# Altium schematic sheet ADC_8681.SchDoc: source ADC
size A4; Author: Watzek; DrawnBy: Watzek; Organization: HTL Hollabrunn; Address1: Abteilung Elektronik; Address2: Anton Ehrenfried-Straße 10; Address3: 2020 Hollabrunn; DocumentNumber: 04; Revision: 01; SheetNumber: 04; SheetTotal: 12; SPICEModelCacheSWPEVHXS: <root> / <DocumentId>SWPEVHXS</DocumentId> / <CacheFrame Number="0"> / <Model Name="cap" Kind="MDL"> / <Text>*Default semiconductor capacitor / .MODEL CAP C()</Text> / </Model> / </CacheFrame> / </root>
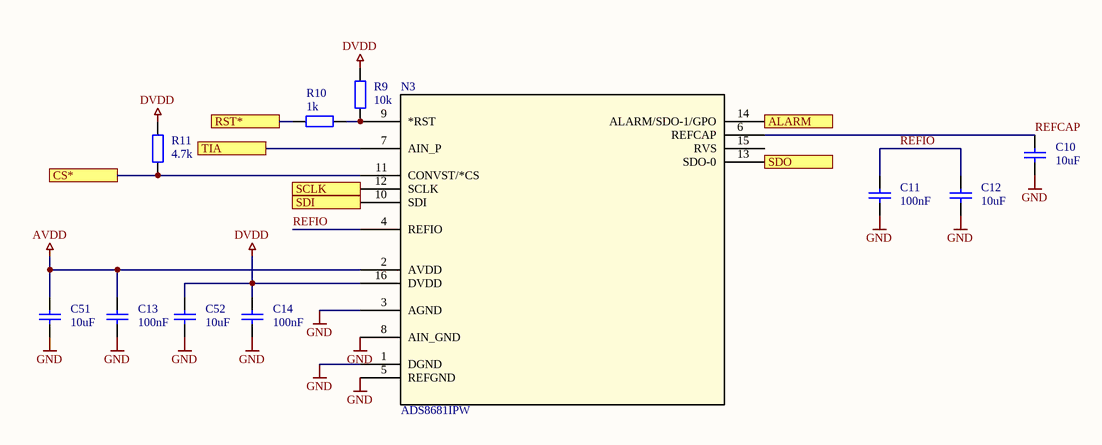
[diagram p0: ADC_8681.SchDoc]

## Parts
C10  10uF  [C1206-KUE]
C11  100nF  [C1206-KUE]
C12  10uF  [C1206-KUE]
C13  100nF  [C1206-KUE]
C14  100nF  [C1206-KUE]
C51  10uF  [C1206-KUE]
C52  10uF  [C1206-KUE]
N3  ADS8681IPW  [PW16_TEX]
R9  10k  [C1206-KUE]
R10  1k  [C1206-KUE]
R11  4.7k  [C1206-KUE]

## Ports
ALARM, CS*, RST*, SCLK, SDI, SDO, TIA

## Nets
AVDD: C13.2 C51.2 N3.2(AVDD)
DVDD: C14.2 C52.2 N3.16(DVDD) R9.1 R11.1
GND: C10.1 C11.1 C12.1 C13.1 C14.1 C51.1 C52.1 N3.1(DGND) N3.3(AGND) N3.5(REFGND) N3.8(AIN_GND)
ALARM: N3.14(ALARM/SDO-1/GPO) ; port ALARM
CS*: N3.11(CONVST/*CS) R11.2 ; port CS*
REFCAP: C10.2 N3.6(REFCAP)
REFIO: C11.2 C12.2 N3.4(REFIO)
RST*: R10.1 ; port RST*
SCLK: N3.12(SCLK) ; port SCLK
SDI: N3.10(SDI) ; port SDI
SDO: N3.13(SDO-0) ; port SDO
TIA: N3.7(AIN_P) ; port TIA
NetN3_9: N3.9(*RST) R9.2 R10.2

Not connected (* = marked no-connect by the designer): N3 15(RVS)

## Notes on the sheet
- Title
- Size:
- Date:
- A4
- Number:
- Time:
- Revision:
- Sheet
- of
- HTL Hollabrunn
- Abteilung Elektronik
- Anton Ehrenfried-Straße 10
- 2020 Hollabrunn
- File:
- Drawn By:

## Library data of the parts
C10-C14 C51 C52 = Capacitor: Manufacturer: Kemet; Bezeichnung: Kerko +-10% 63V; Published: 8-Jun-2000; LatestRevisionDate: 17-Jul-2002; LatestRevisionNote: Re-released for DXP Platform.; PackageReference: RAD-0.3; Publisher: Altium Limited; PackageDescription: Radial Cap, Thru-Hole; 2 Leads; 0.3 in Pin Spacing; Orderingcode: *
  C10 C12 C51 C52: Value: 10uF
  C11 C13 C14: Value: 100nF
N3 = ADS8681IPW: 16-bit, 1MSPS 1-ch SAR ADC with programmable (Â±12V, Â±10V, Â±6V, Â±5V, Â±2.5V) input ranges on 5V supply 16-TSSOP -40 to 125; Manufacturer_Name: Texas Instruments; Copyright: Copyright (C) 2025 Ultra Librarian. All rights reserved.; Manufacturer_Part_Number: ADS8681IPW; RefDes: RefDes; Type: Type
R9-R11 = ResistorSMD: Resistor SMD; Manufacturer: AVX; Bezeichnung: SMD Wid. 1/8W 2%; Published: 8-Jun-2000; LatestRevisionDate: 17-Jul-2002; LatestRevisionNote: Re-released for DXP Platform.; PackageReference: AXIAL-0.4; Publisher: Altium Limited; PackageDescription: Axial Device, Thru-Hole; 2 Leads; 0.4 in Pin Spacing; Orderingcode: *
  R9: Value: 10k
  R10: Value: 1k
  R11: Value: 4.7k